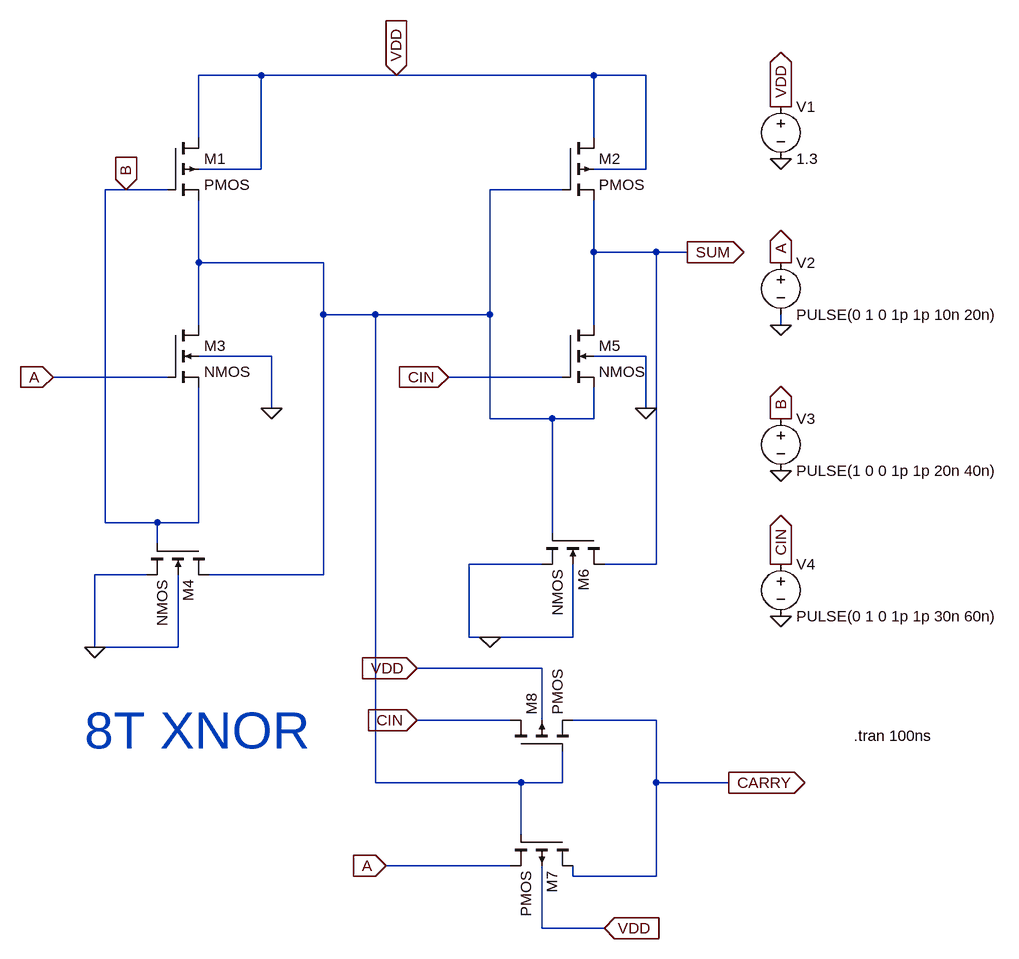
[diagram p0: schematic XNOR 8T.asc]
XNOR 8T.asc, the LTspice schematic file:
Version 4
SHEET 1 1496 1324
WIRE 352 -48 256 -48
WIRE 560 -48 352 -48
WIRE 864 -48 560 -48
WIRE 944 -48 864 -48
WIRE 256 48 256 -48
WIRE 864 48 864 -48
WIRE 352 96 352 -48
WIRE 352 96 256 96
WIRE 944 96 944 -48
WIRE 944 96 864 96
WIRE 144 128 112 128
WIRE 208 128 144 128
WIRE 816 128 704 128
WIRE 864 224 864 144
WIRE 960 224 864 224
WIRE 1008 224 960 224
WIRE 256 240 256 144
WIRE 448 240 256 240
WIRE 448 320 448 240
WIRE 528 320 448 320
WIRE 704 320 704 128
WIRE 704 320 528 320
WIRE 256 336 256 240
WIRE 864 336 864 224
WIRE 1152 336 1152 320
WIRE 368 384 256 384
WIRE 944 384 864 384
WIRE 208 416 32 416
WIRE 816 416 640 416
WIRE 368 464 368 384
WIRE 944 464 944 384
WIRE 704 480 704 320
WIRE 800 480 704 480
WIRE 864 480 864 432
WIRE 864 480 800 480
WIRE 112 640 112 128
WIRE 192 640 112 640
WIRE 256 640 256 432
WIRE 256 640 192 640
WIRE 800 656 800 480
WIRE 192 672 192 640
WIRE 784 704 672 704
WIRE 960 704 960 224
WIRE 960 704 880 704
WIRE 176 720 96 720
WIRE 448 720 448 320
WIRE 448 720 272 720
WIRE 672 816 672 704
WIRE 704 816 672 816
WIRE 832 816 832 704
WIRE 832 816 704 816
WIRE 96 832 96 720
WIRE 224 832 224 720
WIRE 224 832 96 832
WIRE 784 864 592 864
WIRE 736 944 592 944
WIRE 784 944 784 864
WIRE 960 944 832 944
WIRE 528 1040 528 320
WIRE 752 1040 528 1040
WIRE 816 1040 816 992
WIRE 816 1040 752 1040
WIRE 960 1040 960 944
WIRE 1072 1040 960 1040
WIRE 752 1120 752 1040
WIRE 736 1168 544 1168
WIRE 832 1184 832 1168
WIRE 960 1184 960 1040
WIRE 960 1184 832 1184
WIRE 784 1264 784 1168
WIRE 880 1264 784 1264
FLAG 1008 224 SUM
IOPIN 1008 224 Out
FLAG 560 -48 VDD
IOPIN 560 -48 In
FLAG 144 128 B
IOPIN 144 128 In
FLAG 32 416 A
IOPIN 32 416 In
FLAG 368 464 0
FLAG 640 416 CIN
IOPIN 640 416 In
FLAG 592 864 VDD
IOPIN 592 864 In
FLAG 592 944 CIN
IOPIN 592 944 In
FLAG 544 1168 A
IOPIN 544 1168 In
FLAG 880 1264 VDD
IOPIN 880 1264 In
FLAG 1072 1040 CARRY
IOPIN 1072 1040 Out
FLAG 944 464 0
FLAG 96 832 0
FLAG 1152 80 0
FLAG 1152 336 0
FLAG 1152 560 0
FLAG 1152 784 0
FLAG 1152 0 VDD
IOPIN 1152 0 Out
FLAG 1152 240 A
IOPIN 1152 240 Out
FLAG 1152 480 B
IOPIN 1152 480 Out
FLAG 1152 704 CIN
IOPIN 1152 704 Out
FLAG 704 816 0
SYMBOL pmos4 208 48 R0
SYMATTR InstName M1
SYMBOL pmos4 816 48 R0
SYMATTR InstName M2
SYMBOL nmos4 208 336 R0
SYMATTR InstName M3
SYMBOL nmos4 272 672 R90
SYMATTR InstName M4
SYMBOL nmos4 816 336 R0
SYMATTR InstName M5
SYMBOL nmos4 880 656 R90
SYMATTR InstName M6
SYMBOL pmos4 736 992 R270
SYMATTR InstName M8
SYMBOL voltage 1152 -16 R0
SYMATTR InstName V1
SYMATTR Value 1.3
SYMBOL voltage 1152 224 R0
SYMATTR InstName V2
SYMATTR Value PULSE(0 1 0 1p 1p 10n 20n)
SYMBOL voltage 1152 464 R0
SYMATTR InstName V3
SYMATTR Value PULSE(1 0 0 1p 1p 20n 40n)
SYMBOL voltage 1152 688 R0
SYMATTR InstName V4
SYMATTR Value PULSE(0 1 0 1p 1p 30n 60n)
SYMBOL pmos4 832 1120 R90
SYMATTR InstName M7
TEXT 1264 968 Left 2 !.tran 100ns
TEXT 80 960 Left 6 ;8T XNOR

The netlist it stands for:
* XNOR 8T.asc
M1 VDD B N001 VDD PMOS
M2 VDD N001 SUM VDD PMOS
M3 N001 A B 0 NMOS
M4 N001 B 0 0 NMOS
M5 SUM CIN N001 0 NMOS
M6 SUM N001 0 0 NMOS
M8 CIN N001 CARRY VDD PMOS
V1 VDD 0 1.3
V2 A 0 PULSE(0 1 0 1p 1p 10n 20n)
V3 B 0 PULSE(1 0 0 1p 1p 20n 40n)
V4 CIN 0 PULSE(0 1 0 1p 1p 30n 60n)
M7 CARRY N001 A VDD PMOS
.model NMOS NMOS
.model PMOS PMOS
.lib standard.mos
.tran 100ns
* 8T XNOR
.backanno
.end